# EAGLE design MPU-6050 Shield (EAGLE 7.6.0)
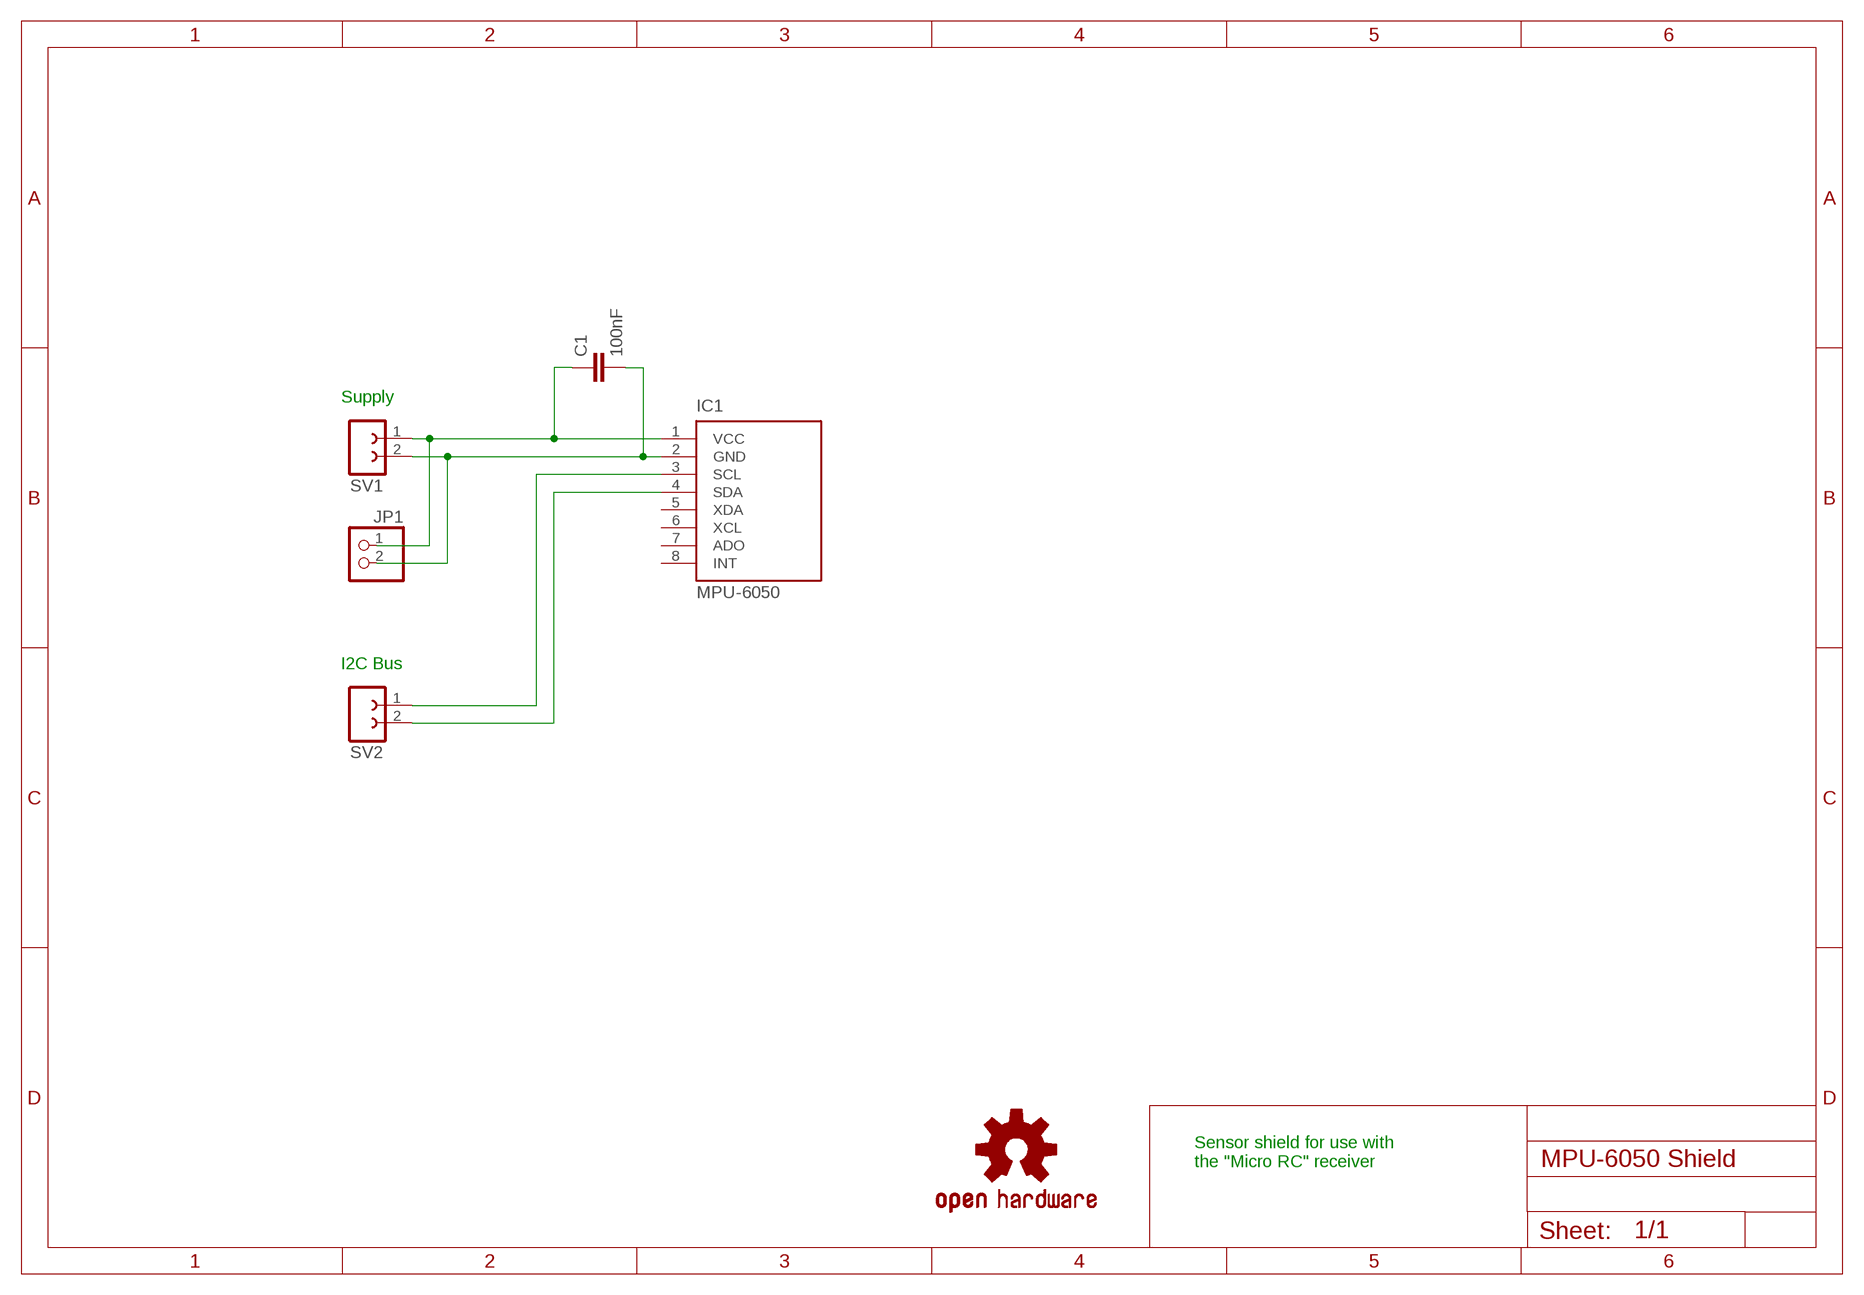
[diagram p0: schematic, sheet 1]

## Parts
C1  100nF  C-EUC0805  [C0805]
IC1  MPU-6050  [MPU-6050_GY521]
JP1  PINHD-1X2  [1X02]
LOGO1  OSHW-LOGOS  [OSHW-LOGO-S]
SV1  FE02-1  [FE02-1]
SV2  FE02-1  [FE02-1]

## Nets
GND: C1.2 IC1.2(GND) JP1.2 SV1.2
N$1: IC1.3(SCL) SV2.1
N$2: IC1.4(SDA) SV2.2
VCC: C1.1 IC1.1(VCC) JP1.1 SV1.1
Unconnected: IC1.5(XDA) IC1.6(XCL) IC1.7(ADO) IC1.8(INT)

## Notes on the sheet
- Supply
- I2C Bus
- Sensor shield for use with
  the "Micro RC" receiver

## Library data of the parts
C1 = rcl:C-EU: CAPACITOR, European symbol
IC1 = 00_custom:MPU-6050: Gyro / Accelerometer Module GY-521
JP1 = 00_custom_pinhead:PINHD-1X2: PIN HEADER
LOGO1 = SparkFun-Aesthetics:OSHW-LOGO: Open Source Hardware Logo This logo indicates the piece of hardware it is found on incorporates a OSHW license and/or adheres to the definition of open source hardware found here: http://freedomdefined.org/OSHW
SV1 SV2 = 00_custom:FE02-1: FEMALE HEADER

## Board
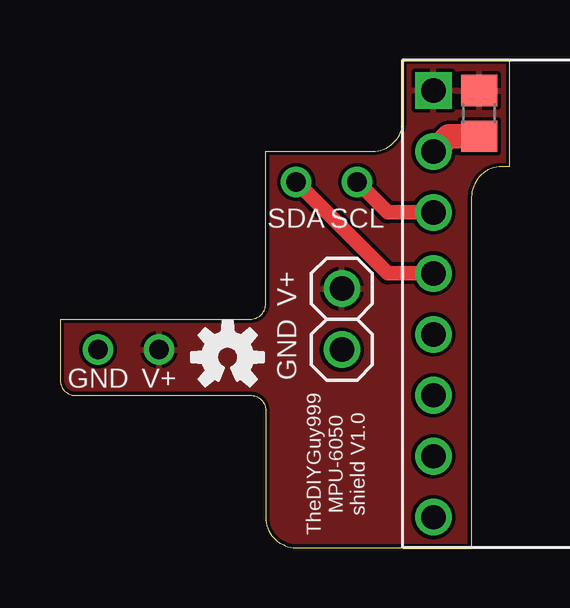
[diagram p1: board, top side]
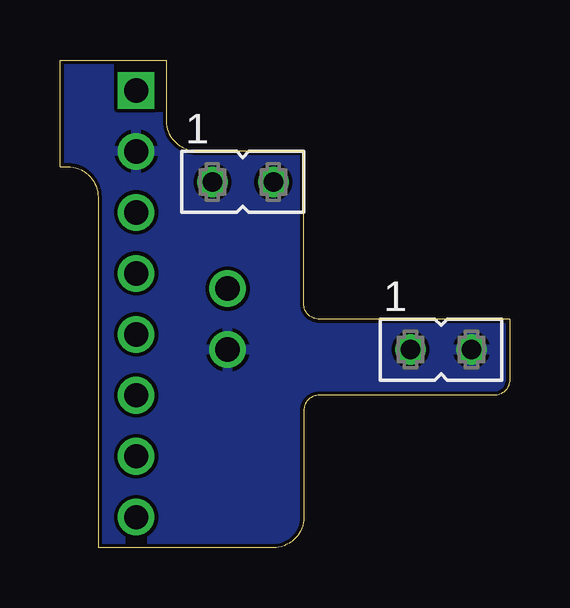
[diagram p2: board, bottom side, seen from below]

Size 18.73 x 20.32 mm. Coordinates in mm from the lower left corner, seen from the top.
Outline: 0,9.53 7.94,9.53 arc90 8.57,10.16 8.57,16.51 13.02,16.51 arc90 14.29,17.78 14.29,20.32 18.73,20.32 18.73,15.88 18.41,15.88 arc90 17.15,14.61 17.15,0 9.84,0 arc-90 8.57,1.27 8.57,5.71 arc90 7.94,6.35 0.63,6.35 arc-90 0,6.99 0,9.53
Copper layers (1*16): Top 0.0356mm / dielectric 1.5011mm / Bottom 0.0356mm
Design rules "MPU-6050 Shield": minimum track width 6mil, minimum drill 13mil, track to track 6mil, track to pad 6mil, pad to pad 6mil, via to via 6mil, smd to smd 6mil, copper to edge 6mil, drill to drill 6mil, minimum pad ring 5mil, minimum via ring 7mil, stop-mask expansion 1mil, vias tented up to drill 24mil, thermal gap 6mil

### Footprints (pad centres in the part's own frame; a part is rotated, then mirrored left to right if it is on the bottom)
C0805 = smd 1.3 x 1.5: 1 -0.95,0; 2 0.95,0
MPU-6050_GY521 = drill 1.016 pad 1.524 square: 1 1.27,19.05 | drill 1.016 pad 1.524: 2 1.27,16.51; 3 1.27,13.97; 4 1.27,11.43; 5 1.27,8.89; 6 1.27,6.35; 7 1.27,3.81; 8 1.27,1.27
1X02 = drill 1.016 pad 1.524: 1 -1.27,0; 2 1.27,0
FE02-1 = drill 0.813 pad 1.27: 1 -1.27,0; 2 1.27,0

### Placement (x,y rotation side)
C1  17.46,18.1 270 top
IC1  14.29,0 0 top
JP1  11.75,9.53 270 top
LOGO1  6.99,7.94 0 top
SV1  2.86,8.26 0 bottom
SV2  11.11,15.24 0 bottom

### Tracks (layer width: path | path; a pad name or v marks a point on that pad's centre or on a via)
GND
  Top 1.016: C1.2 16.2,17.15 IC1.2
  pour Bottom: -3.49,-3.17 -3.49,23.49 23.18,23.49 23.18,-2.54 arc-90 22.54,-3.17
N$1
  Top 0.61: IC1.3 13.65,13.97 SV2.1
N$2
  Top 0.61: IC1.4 13.65,11.43 SV2.2
VCC
  pour Top: -2.22,-1.91 21.91,-1.91 21.91,22.22 -2.22,22.22

### Text on the board
tNames: SDA | SCL | V+ | GND | GND | V+ | TheDIYGuy999 / MPU-6050 / shield V1.0